# EAGLE design processor board (EAGLE 6.3)
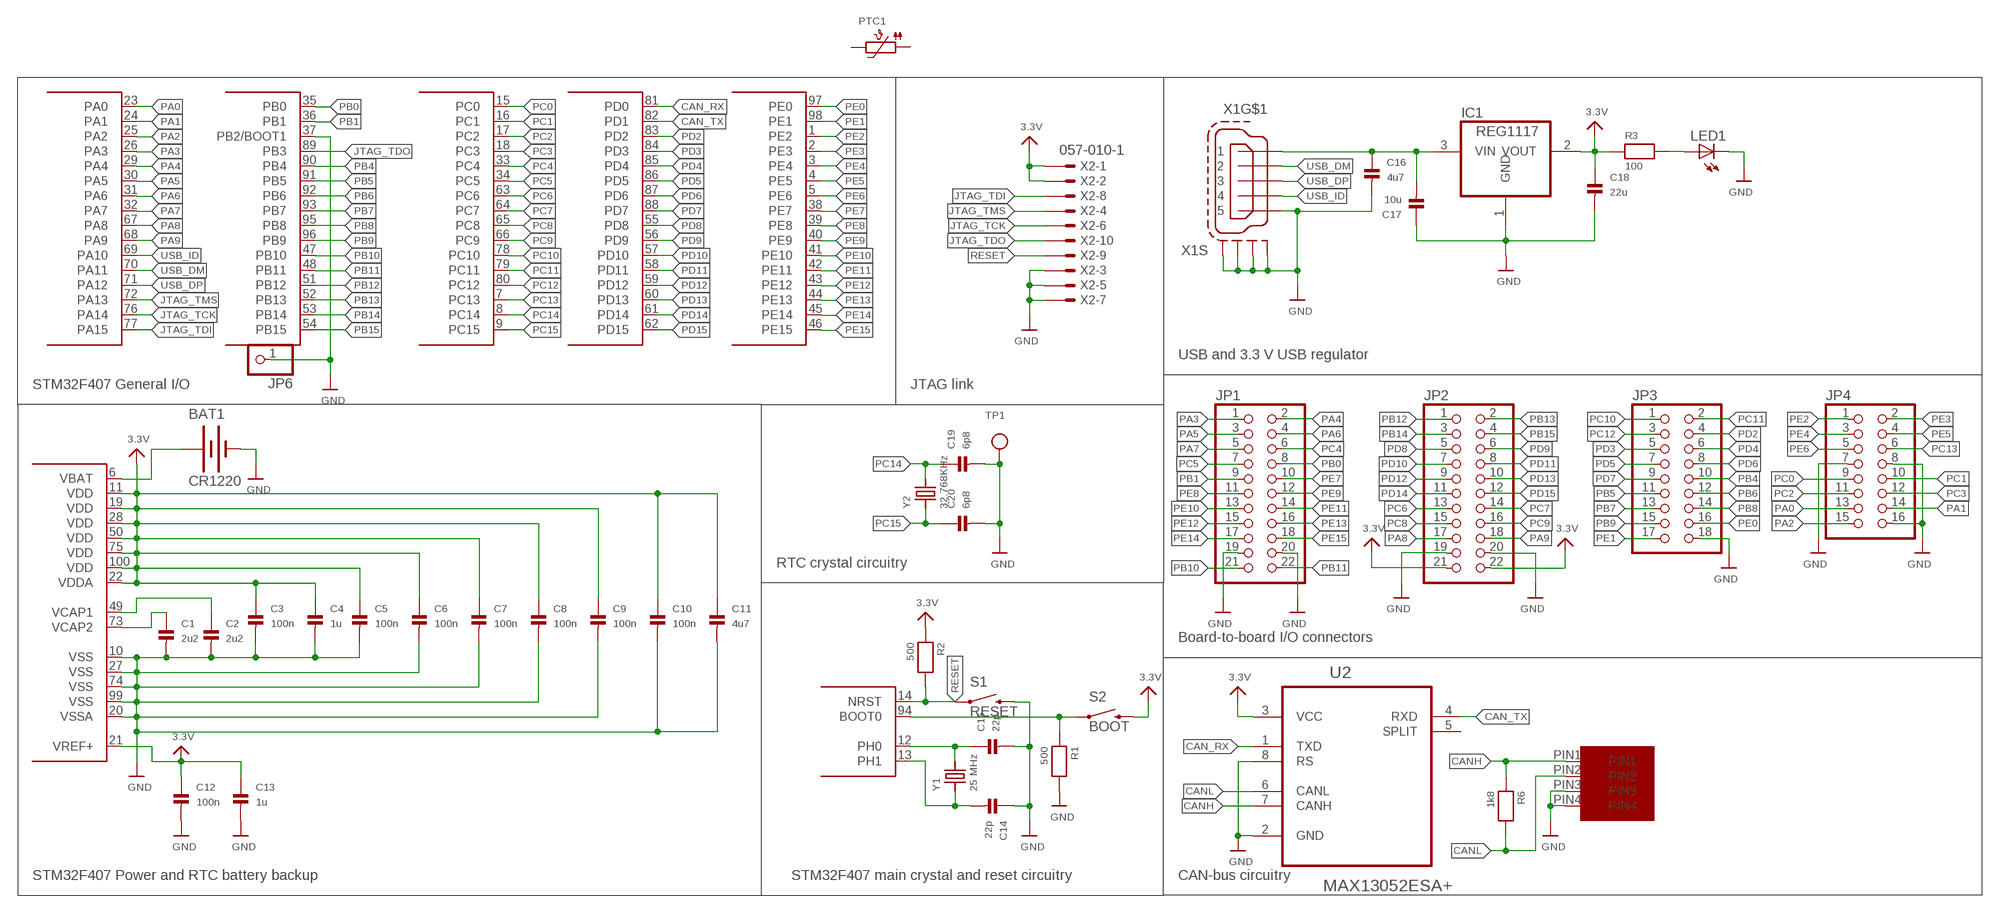
[diagram p0: schematic, sheet 1]

## Parts
BAT1  CR1220  BATTERY12PTH  [BATTCON_12MM_PTH]
C1  2u2  CAP_CERAMIC_0603MP  [_0603MP]
C2  2u2  CAP_CERAMIC_0603MP  [_0603MP]
C3  100n  CAP_CERAMIC_0603MP  [_0603MP]
C4  1u  CAP_CERAMIC_0603MP  [_0603MP]
C5  100n  CAP_CERAMIC_0603MP  [_0603MP]
C6  100n  CAP_CERAMIC_0603MP  [_0603MP]
C7  100n  CAP_CERAMIC_0603MP  [_0603MP]
C8  100n  CAP_CERAMIC_0603MP  [_0603MP]
C9  100n  CAP_CERAMIC_0603MP  [_0603MP]
C10  100n  CAP_CERAMIC_0603MP  [_0603MP]
C11  4u7  CAP_CERAMIC_0603MP  [_0603MP]
C12  100n  CAP_CERAMIC_0603MP  [_0603MP]
C13  1u  CAP_CERAMIC_0603MP  [_0603MP]
C14  22p  CAP_CERAMIC_0603MP  [_0603MP]
C15  22p  CAP_CERAMIC_0603MP  [_0603MP]
C16  4u7  CAP_CERAMIC_0603MP  [_0603MP]
C17  10u  CAP_CERAMIC_0603MP  [_0603MP]
C18  22u  CAP_CERAMIC_0603MP  [_0603MP]
C19  6p8  CAP_CERAMIC_0603MP  [_0603MP]
C20  6p8  CAP_CERAMIC_0603MP  [_0603MP]
IC1  REG1117  [SOT223]
JP1  PINHD-2X11  [2X11]
JP2  PINHD-2X11  [2X11]
JP3  PINHD-2X9  [2X09]
JP4  PINHD-2X8  [2X08]
JP6  PINHD-1X1  [1X01]
LED1  LEDCHIPLED_1206  [CHIPLED_1206]
PTC1  PTC1206  [1206]
R1  500  RESISTOR_0603MP  [_0603MP]
R2  500  RESISTOR_0603MP  [_0603MP]
R3  100  RESISTOR_0603MP  [_0603MP]
R6  1k8  RESISTOR_0603MP  [_0603MP]
S1  RESET  SWITCH-MOMENTARY-2SMD-1101NE  [TACTILE-SWITCH-1101NE]
S2  BOOT  SWITCH-MOMENTARY-2SMD-1101NE  [TACTILE-SWITCH-1101NE]
TP1  TESTPOINT0.1"  [1X01_ROUND]
U1  STM32F4-100  [SQFP-S-14X14-100]
U2  MAX13052ESA+  [SOIC127P600X175-8N]
U$23  MICROFIT4  [MICROFIT4SOCK]
X1  MINI-USB-SCHIELD-32005-201  [32005-201]
X2  057-010-1  [057-010-1]
Y1  25 MHz  CRYSTAL2.5X2.0MM  [CRYSTAL_2.5X2]
Y2  32.768KHz  CRYSTAL32.768  [CRYSTAL_CYL_2X6MM_SMT]

## Nets
3.3V: C3.1 C4.1 C5.1 C6.1 C7.1 C8.1 C9.1 C10.1 C11.1 C12.1 C13.1 C18.1 IC1.2(VOUT) JP2.21 JP2.22 R2.1 R3.1 S2.2 U1.11(VDD) U1.19(VDD) U1.21(VREF+) U1.22(VDDA) U1.28(VDD) U1.50(VDD) U1.75(VDD) U1.100(VDD) U2.3(VCC) X2.1 X2.2
CAN_RX: U1.81(PD0) U2.1(TXD)
CAN_TX: U1.82(PD1) U2.4(RXD)
CANH: R6.1 U2.7(CANH) U$23.PIN1
CANL: R6.2 U2.6(CANL) U$23.PIN2
GND: BAT1.GND(-) C1.2 C2.2 C3.2 C4.2 C5.2 C6.2 C7.2 C8.2 C9.2 C10.2 C11.2 C12.2 C13.2 C14.1 C15.2 C16.2 C17.1 C18.2 C19.2 C20.2 IC1.1(GND) JP1.19 JP1.20 JP2.19 JP2.20 JP3.18 JP4.7 JP4.8 JP4.16 JP6.1 LED1.C R1.2 S1.2 TP1.1 U1.10(VSS) U1.20(VSSA) U1.27(VSS) U1.37(PB2/BOOT1) U1.74(VSS) U1.99(VSS) U2.2(GND) U2.8(RS) U$23.PIN3 U$23.PIN4 X1.5 X1.M1(S:S1) X1.M2(S:S2) X1.M3(S:S3) X1.M4(S:S4) X2.3 X2.5 X2.7
JTAG_TCK: U1.76(PA14) X2.6
JTAG_TDI: U1.77(PA15) X2.8
JTAG_TDO: U1.89(PB3) X2.10
JTAG_TMS: U1.72(PA13) X2.4
N$1: C15.1 U1.12(PH0) Y1.3
N$2: C1.1 U1.73(VCAP2)
N$3: C2.1 U1.49(VCAP1)
N$4: R1.1 S2.1 U1.94(BOOT0)
N$5: LED1.A R3.2
N$6: BAT1.VCC@1(+) U1.6(VBAT)
N$11: C14.2 U1.13(PH1) Y1.1
PA0: JP4.13 U1.23(PA0)
PA1: JP4.14 U1.24(PA1)
PA2: JP4.15 U1.25(PA2)
PA3: JP1.1 U1.26(PA3)
PA4: JP1.2 U1.29(PA4)
PA5: JP1.3 U1.30(PA5)
PA6: JP1.4 U1.31(PA6)
PA7: JP1.5 U1.32(PA7)
PA8: JP2.17 U1.67(PA8)
PA9: JP2.18 U1.68(PA9)
PB0: JP1.8 U1.35(PB0)
PB1: JP1.9 U1.36(PB1)
PB4: JP3.10 U1.90(PB4)
PB5: JP3.11 U1.91(PB5)
PB6: JP3.12 U1.92(PB6)
PB7: JP3.13 U1.93(PB7)
PB8: JP3.14 U1.95(PB8)
PB9: JP3.15 U1.96(PB9)
PB10: JP1.21 U1.47(PB10)
PB11: JP1.22 U1.48(PB11)
PB12: JP2.1 U1.51(PB12)
PB13: JP2.2 U1.52(PB13)
PB14: JP2.3 U1.53(PB14)
PB15: JP2.4 U1.54(PB15)
PC0: JP4.9 U1.15(PC0)
PC1: JP4.10 U1.16(PC1)
PC2: JP4.11 U1.17(PC2)
PC3: JP4.12 U1.18(PC3)
PC4: JP1.6 U1.33(PC4)
PC5: JP1.7 U1.34(PC5)
PC6: JP2.13 U1.63(PC6)
PC7: JP2.14 U1.64(PC7)
PC8: JP2.15 U1.65(PC8)
PC9: JP2.16 U1.66(PC9)
PC10: JP3.1 U1.78(PC10)
PC11: JP3.2 U1.79(PC11)
PC12: JP3.3 U1.80(PC12)
PC13: JP4.6 U1.7(PC13)
PC14: C19.1 U1.8(PC14) Y2.2
PC15: C20.1 U1.9(PC15) Y2.1
PD2: JP3.4 U1.83(PD2)
PD3: JP3.5 U1.84(PD3)
PD4: JP3.6 U1.85(PD4)
PD5: JP3.7 U1.86(PD5)
PD6: JP3.8 U1.87(PD6)
PD7: JP3.9 U1.88(PD7)
PD8: JP2.5 U1.55(PD8)
PD9: JP2.6 U1.56(PD9)
PD10: JP2.7 U1.57(PD10)
PD11: JP2.8 U1.58(PD11)
PD12: JP2.9 U1.59(PD12)
PD13: JP2.10 U1.60(PD13)
PD14: JP2.11 U1.61(PD14)
PD15: JP2.12 U1.62(PD15)
PE0: JP3.16 U1.97(PE0)
PE1: JP3.17 U1.98(PE1)
PE2: JP4.1 U1.1(PE2)
PE3: JP4.2 U1.2(PE3)
PE4: JP4.3 U1.3(PE4)
PE5: JP4.4 U1.4(PE5)
PE6: JP4.5 U1.5(PE6)
PE7: JP1.10 U1.38(PE7)
PE8: JP1.11 U1.39(PE8)
PE9: JP1.12 U1.40(PE9)
PE10: JP1.13 U1.41(PE10)
PE11: JP1.14 U1.42(PE11)
PE12: JP1.15 U1.43(PE12)
PE13: JP1.16 U1.44(PE13)
PE14: JP1.17 U1.45(PE14)
PE15: JP1.18 U1.46(PE15)
RESET: R2.2 S1.1 U1.14(NRST) X2.9
USB_DM: U1.70(PA11) X1.2
USB_DP: U1.71(PA12) X1.3
USB_ID: U1.69(PA10) X1.4
USB_VBUS: C16.1 C17.2 IC1.3(VIN) X1.1
Unconnected: PTC1.1 PTC1.2 U2.5(SPLIT)

## Notes on the sheet
- USB and 3.3 V USB regulator
- STM32F407 General I/O | JTAG link
- RTC crystal circuitry
- Board-to-board I/O connectors
- STM32F407 Power and RTC battery backup | STM32F407 main crystal and reset circuitry | CAN-bus circuitry

## Library data of the parts
BAT1 = SparkFun-Electromechanical:BATTERY: Battery Holders Various common sizes : AA, AAA, 18650 (PRT-12895), 20mm coin cell and 12mm coin cell. 20MM_4LEGS, BATT-10373; PROD_ID: BATT-08315
C1-C20 = microbuilder:CAP_CERAMIC: Ceramic Capacitors 0402 - 0402 Surface Mount Capacitors 16pF 50V 5% [Digikey: 445-4899-2-ND] 18pF 50V 5% [Digikey: 490-1281-2-ND] 22pF 50V 5% [Digikey: 490-1283-2-ND] 68pF 50V 5% [Digikey: 490-1289-2-ND] 0.1uF 10V 10% [Digikey: 490-1318-2-ND] 1.0uF 6.3V 10% [Digikey: 490-1320-2-ND] 0603 - 0603 Surface Mount Capacitors 16 pF 50V 5% [Digikey: 445-5051-2-ND] 22 pF 50V [Digikey: PCC220ACVTR-ND] 33 pF 50V 5% [Digikey: 490-1415-1-ND] 56pF 50V 5% [Digikey: 490-1421-1-ND] 220pF 50V 5% [Digikey: 445-1285-1-ND] 680 pF 50V 2200 pF 50V 5% C0G [Digikey: 445-1297-1-ND] 5600 pF 100V 5% X7R [Digikey: 478-3711-1-ND] 0.1 µF 25V 10% [Digikey: PCC2277TR-ND] 0.22 µF 16V 10% X7R [Digikey: 445-1318-1-ND] 1.0 µF 25V 10% [Digikey: 445-5146-2-ND] 0603 - RF Specific 3pF 250V +/-0.1pF RF [Digikey: 712-1347-1-ND] 18 pF 250V 5% [Digikey: 478-3505-1-ND or 712-1322-1-ND] 56 pF 250V 5% C0G RF [Digikey: 490-4867-1-ND] 68 pF 250V RF [Digikey: 490-4868-1-ND] 0805 - 0805 Surface Mount Capacitors 220 pF 250V 2% RF Ceramic Capacitor [Digikey: 712-1398-1-ND] 1000 pF 50V 2% NP0 Ceramic Capacitor [Digikey: 478-3760-1-ND] 0.1 µF 25V 10% Ceramic Capacitor [Digikey: PCC1828TR-ND] 1.0 µF 16V 10% Ceramic Capacitor[Digikey: 490-1691-2-ND] 10.0 µF 10V 10% Ceramic Capacitor[Digikey: 709-1228-1-ND] 10.0 uF 16V 10% Ceramic Capacitor [Digikey: 478-5165-2-ND] 47 uF 6.3V 20% Ceramic Capacitor [Digikey: 587-1779-1-ND or 399-5506-1-ND] 1206 - 1206 Surface Mount Capacitors 47uF 10V 20% Ceramic Capacitor [Digikey: 490-5528-1-ND or 399-5508-1-ND or 445-6010-1-ND] 100uF 6.3V -20%, +80% Y5V Ceramic Capacitor (Digikey: 490-4512-1-ND, Mouser: 81-GRM31CF50J107ZE1L)
IC1 = burr-brown:REG1117: 800mA and 1A Low Dropout (LDO) Positive Regulator 1.8V, 2.5V, 2.85V, 3.3V, 5V, and Adj; MPN: REG1117; OC_FARNELL: 1097566; OC_NEWARK: 14P6981
JP1 JP2 = pinhead:PINHD-2X11: PIN HEADER
JP3 = pinhead:PINHD-2X9: PIN HEADER
JP4 = pinhead:PINHD-2X8: PIN HEADER
JP6 = pinhead:PINHD-1X1: PIN HEADER
LED1 = led:LED: LED OSRAM: - CHIPLED LG R971, LG N971, LY N971, LG Q971, LY Q971, LO R971, LY R971 LH N974, LH R974 LS Q976, LO Q976, LY Q976 LO Q996 - Hyper CHIPLED LW Q18S LB Q993, LB Q99A, LB R99A - SideLED LS A670, LO A670, LY A670, LG A670, LP A670 LB A673, LV A673, LT A673, LW A673 LH A674 LY A675 LS A676, LA A676, LO A676, LY A676, LW A676 LS A679, LY A679, LG A679 - Hyper Micro SIDELED® LS Y876, LA Y876, LO Y876, LY Y876 LT Y87S - SmartLED LW L88C, LW L88S LB L89C, LB L89S, LG L890 LS L89K, LO L89K, LY L89K LS L896, LA L896, LO L896, LY L896 - TOPLED LS T670, LO T670, LY T670, LG T670, LP T670 LSG T670, LSP T670, LSY T670, LOP T670, LYG T670 LG T671, LOG T671, LSG T671 LB T673, LV T673, LT T673, LW T673 LH T674 LS T676, LA T676, LO T676, LY T676, LB T676, LH T676, LSB T676, LW T676 LB T67C, LV T67C, LT T67C, LS T67K, LO T67K, LY T67K, LW E67C LS E67B, LA E67B, LO E67B, LY E67B, LB E67C, LV E67C, LT E67C LW T67C LS T679, LY T679, LG T679 LS T770, LO T770, LY T770, LG T770, LP T770 LB T773, LV T773, LT T773, LW T773 LH T774 LS E675, LA E675, LY E675, LS T675 LS T776, LA T776, LO T776, LY T776, LB T776 LHGB T686 LT T68C, LB T68C - Hyper Mini TOPLED® LB M676 - Mini TOPLED Santana® LG M470 LS M47K, LO M47K, LY M47K Source: http://www.osram.convergy.de LUXEON: - LUMILED® LXK2-PW12-R00, LXK2-PW12-S00, LXK2-PW14-U00, LXK2-PW14-V00 LXK2-PM12-R00, LXK2-PM12-S00, LXK2-PM14-U00 LXK2-PE12-Q00, LXK2-PE12-R00, LXK2-PE12-S00, LXK2-PE14-T00, LXK2-PE14-U00 LXK2-PB12-K00, LXK2-PB12-L00, LXK2-PB12-M00, LXK2-PB14-N00, LXK2-PB14-P00, LXK2-PB14-Q00 LXK2-PR12-L00, LXK2-PR12-M00, LXK2-PR14-Q00, LXK2-PR14-R00 LXK2-PD12-Q00, LXK2-PD12-R00, LXK2-PD12-S00 LXK2-PH12-R00, LXK2-PH12-S00 LXK2-PL12-P00, LXK2-PL12-Q00, LXK2-PL12-R00 Source: www.luxeon.com KINGBRIGHT: KA-3528ASYC Source: www.kingbright.com
PTC1 = microbuilder:PTC: PTC (Resettable Fuse) 1206 Package 250mA PTC (16V Max, Time-to-Trip: 0.08s) - Digikey: F2110CT-ND 1210 Package 100mA PTC (30V Max, Time-to-Trip: 0.6s) - Digikey: MF-USMF010-2CT-ND 1812 Package 750mA PTC (24V Max, Time-to-Trip: 0.2s) - Digikey: MF-MSMF075/24-2CT-ND
R1-R3 R6 = microbuilder:RESISTOR: Resistors 0402 - 0402 Surface Mount Package 22 Ohm 1% 1/16W [Digikey: 311-22.0LRTR-ND] 33 Ohm 5% 1/16W 1.0K 5% 1/16W 1.5K 5% 1/16W 2.0K 1% 1/16W 10.0K 1% 1/16W [Digikey: 311-10.0KLRTR-ND] 10.0K 5% 1/16W [Digikey: RMCF0402JT10K0TR-ND] 12.1K 1% 1/16W [Digikey: 311-22.0LRTR-ND] 100.0K 5% 1/16W 0603 - 0603 Surface Mount Package 0 Ohm 1/10 Watt 1% Resistor 15 Ohm 1/10 Watt 1% Resistor 33 Ohm 1/10 Watt 1% Resistor 49.9 Ohm 1/10 Watt 1% Resistor 100 Ohm 1/10 Watt 1% Resistor 150 Ohm 1/10 Watt 1% Resistor 240 Ohm 1/10 Watt 1% Resistor 390 Ohm 1/10 Watt 1% Resistor 560 Ohm 1/10 Watt 1% Resistor 680 Ohm 1/10 Watt 1% Resistor 750 Ohm 1/10 Watt 1% Resistor 1.0K Ohm 1/10 Watt 1% Resistor 1.5K Ohm 1/10 Watt 1% Resistor 2.0K Ohm 1/10 Watt 1% Resistor 2.2K Ohm 1/10 Watt 1% Resistor 3.3K Ohm 1/10 Watt 1% Resistor 4.7K Ohm 1/10 Watt 1% Resistor 10.0K Ohm 1/10 Watt 1% Resistor 12.0K Ohm 1/10 Watt 1% Resistor 12.1K Ohm 1/10 Watt 1% Resistor 20.0K Ohm 1/10 Watt 1% Resistor 33.0K Ohm 1/10 Watt 1% Resistor 100.0K Ohm 1/10 Watt 1% Resistor 0805 - 0805 Surface Mount Package 0 Ohm 1/8 Watt 1% Resistor 33 Ohm 1/8 Watt 1% Resistor 100 Ohm 1/8 Watt 1% Resistor 150 Ohm 1/8 Watt 1% Resistor 200 Ohm 1/8 Watt 1% Resistor 240 Ohm 1/8 Watt 1% Resistor 330 Ohm 1/8 Watt 1% Resistor 390 Ohm 1/8 Watt 1% Resistor 470 Ohm 1/8 Watt 1% Resistor 1.0K Ohm 1/8 Watt 1% Resistor 1.5K Ohm 1/8 Watt 1% Resistor 2.0K Ohm 1/8 Watt 1% Resistor 4.7K Ohm 1/8 Watt 1% Resistor 5.1K Ohm 1/8 Watt 1% Resistor 5.6K Ohm 1/8 Watt 1% Resistor 10.0K Ohm 1/8 Watt 1% Resistor 22.0K Ohm 1/8 Watt 1% Resistor 33.0K Ohm 1/8 Watt 1% Resistor 100K Ohm 1/8 Watt 1% Resistor 1206 - 1206 Surface Mount Package 2012 - 2010 Surface Mount Package 0.11 Ohm 1/2 Watt 1% Resistor - Digikey: RHM.11UCT-ND
S1 S2 = SparkFun-Electromechanical:SWITCH-MOMENTARY-2: Various NO switches- pushbuttons, reed, etc; PROD_ID: SWCH-00815
TP1 = microbuilder:TESTPOINT: Test Point Various test points for characterisation and PCB testing TESTPOINT_SMT - Compact Surface Mount Test Point [Digikey: 5016KTR-ND]; BOM: EXCLUDE
U1 = apbteam_stm32:STM32F4-100: STM32F4, 100 pin package According to STM32F40x datasheet, almost compatible with STM32F4xx, STM32F2xx, some pins must be connected differently, see chapter 2.1.
U2 = Maxim_By_element14_Batch_1:MAX13052ESA+: Industry-Standard High-Speed CAN Transceivers with ±80V Fault Protection; MPN: MAX13052ESA+; OC_FARNELL: 1600112; OC_NEWARK: 99K2875; PACKAGE: SOIC-8; SUPPLIER: Maxim
U$23 = unicorn:MICROFIT4
X1 = con-cypressindustries:MINI-USB-SCHIELD-: MINI USB-B Conector Source: www.cypressindustries.com; OC_FARNELL: unknown; OC_NEWARK: unknown
X2 = con-panduit:057-010-: CONNECTOR 10-pin series 057 contact pc board low profile headers; OC_FARNELL: unknown; OC_NEWARK: unknown
Y1 Y2 = microbuilder:CRYSTAL: Crystals HC49UP - Surface Mount Crystal 4.0MHz 18pF +/-30ppm Surface Mount Crystal [Digikey: 535-9857-1-ND] 12.0 MHz Surface Mount Crystal [Digikey: 535-9869-6-ND] 25.0 MHz Surface Mount Crystal [Digikey: 535-9078-1-ND] 2.5 x 2.0mm - MEMs SMT Crystal 16.0 MHz 10pF 20ppm 2.5 x 2.0mm Crystal [Digikey -40-85°C: 535-10923-1-ND] 3.2 x 2.5mm - MEMs SMT Crystal 12.0 MHz 8pF 15ppm 3.2 x 2.5mm Crystal [Digikey: -10-70°C: 644-1047-1-ND -40-125°C: 644-1128-1-ND] 16.0 MHz 8pF 15ppm 3.2 x 2.5mm Crystal [Digikey: -10-70°C: 644-1049-1-ND -40-125°C: 644-1129-2-ND] 16.0 MHz 10pF 10ppm 3.2 x 2.5mm Crystal [Digikey: 644-1100-1-ND] 27.12 MHz 18pF 30ppm 3.2 x 2.5mm Crystal [Digikey: 887-1424-1-ND] 27.12MHz 10pF 10ppm 3.2 x 2.5mm Crystal [Digikey: 887-1329-1-ND] 4.9 x 1.8mm - MEMs SMT Crystal 32.768 KHz 12.5pF 20ppm 4.9 x 1.8mm Crystal [Digikey: SE2415CT-ND] 8.0 x 3.8mm - Surface Mount Crystal 32.768kHz 12.5pF 20ppm -40°C-85°C [Digikey: 535-9166-2-ND] Cylinder 32.768KHz Cylinder Crystal (2x6mm body) [Ex. Digikey: 300-8341-2-ND]

## Board
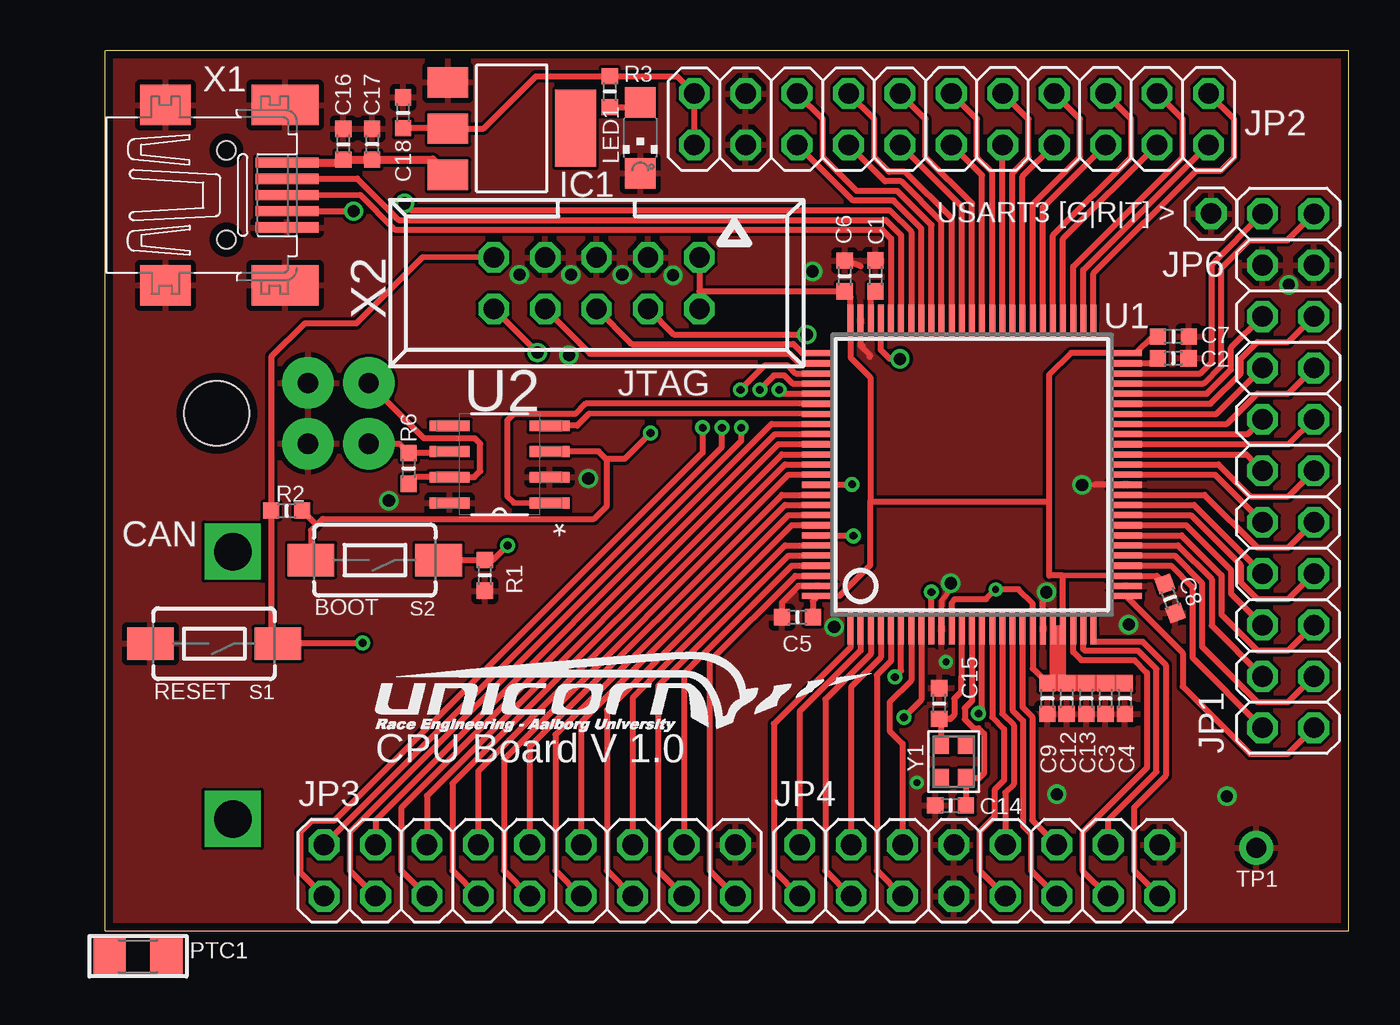
[diagram p1: board, top side]
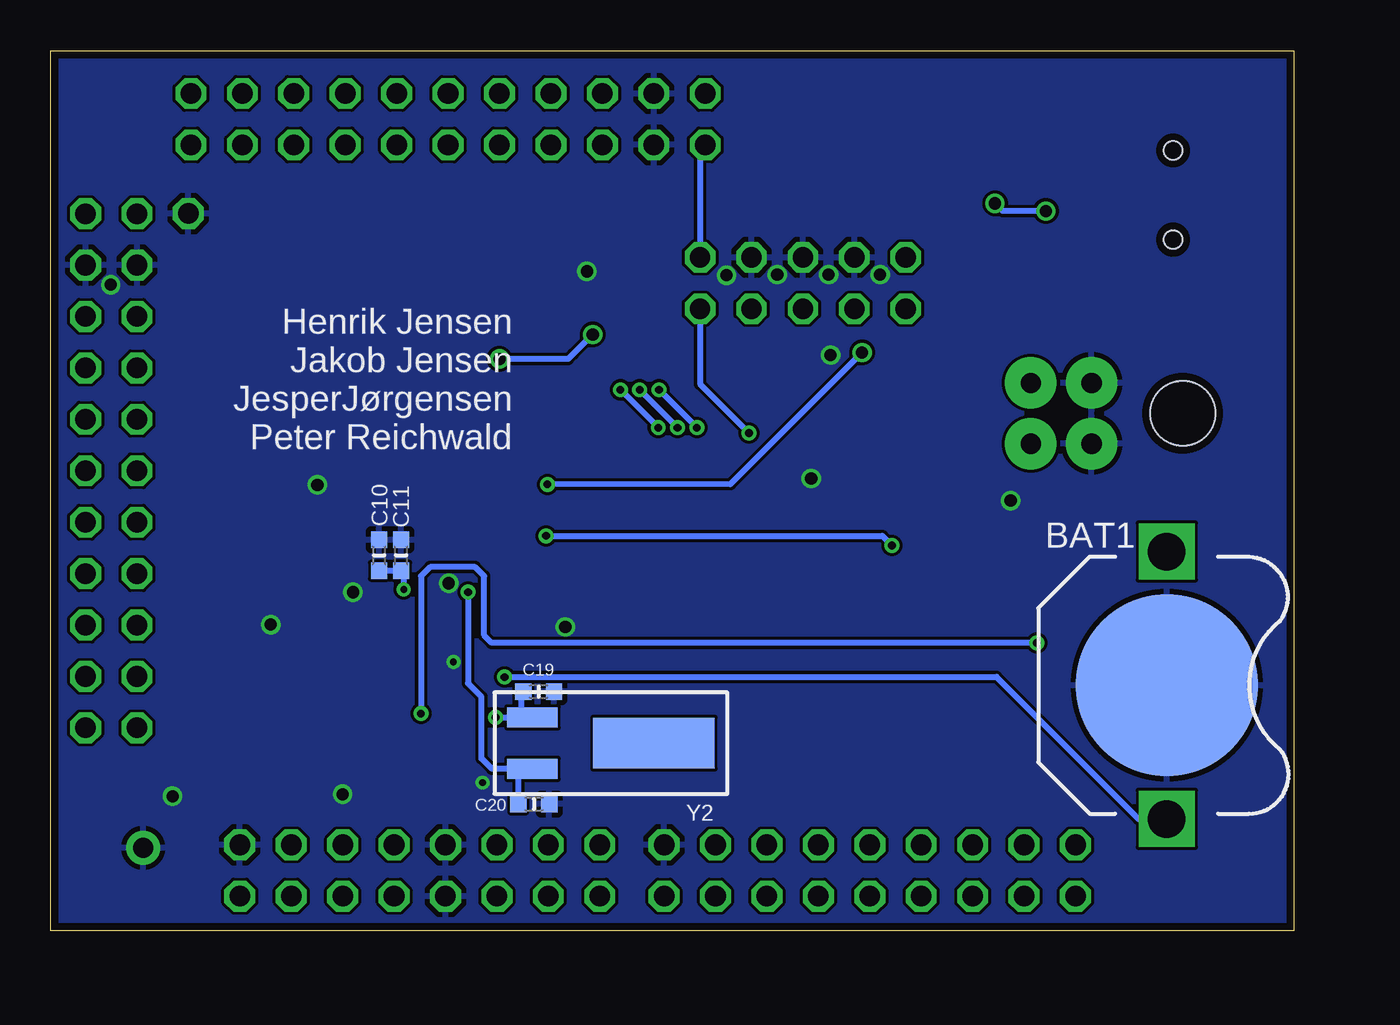
[diagram p2: board, bottom side, seen from below]

Size 61.42 x 43.49 mm. Coordinates in mm from the lower left corner, seen from the top.
Outline: 61.42,0 61.42,43.48 0,43.48
Outline: 61.42,0.01 0,0.01 0,43.49
Copper layers (1*16): Top 0.0356mm / dielectric 1.5011mm / Bottom 0.0356mm
Design rules "LaenPCBOrder *": minimum track width 6mil, minimum drill 13mil, track to track 6mil, track to pad 6mil, pad to pad 6mil, via to via 6mil, smd to smd 6mil, copper to edge 15mil, drill to drill 6mil, minimum pad ring 7mil, minimum via ring 7mil, stop-mask expansion 3mil, vias tented up to drill 0mil, thermal gap 10mil

### Footprints (pad centres in the part's own frame; a part is rotated, then mirrored left to right if it is on the bottom)
BATTCON_12MM_PTH = smd 9 x 9: GND 0,0 | drill 1.854 square: VCC@1 6.604,0; VCC@2 -6.604,0
_0603MP = smd 0.8 x 0.8: 1 -0.762,0; 2 0.762,0
SOT223 = smd 1.499 x 2.007: 1 -2.261,-3.15; 2 0.025,-3.15; 3 2.311,-3.15 | smd 3.81 x 2.007: 4 0,3.15
2X11 = drill 1.016 octagon: 1 -12.7,-1.27; 2 -12.7,1.27; 3 -10.16,-1.27; 4 -10.16,1.27; 5 -7.62,-1.27; 6 -7.62,1.27; 7 -5.08,-1.27; 8 -5.08,1.27; 9 -2.54,-1.27; 10 -2.54,1.27; 11 0,-1.27; 12 0,1.27; 13 2.54,-1.27; 14 2.54,1.27; 15 5.08,-1.27; 16 5.08,1.27; 17 7.62,-1.27; 18 7.62,1.27; 19 10.16,-1.27; 20 10.16,1.27; 21 12.7,-1.27; 22 12.7,1.27
2X09 = drill 1.016 octagon: 1 -10.16,-1.27; 2 -10.16,1.27; 3 -7.62,-1.27; 4 -7.62,1.27; 5 -5.08,-1.27; 6 -5.08,1.27; 7 -2.54,-1.27; 8 -2.54,1.27; 9 0,-1.27; 10 0,1.27; 11 2.54,-1.27; 12 2.54,1.27; 13 5.08,-1.27; 14 5.08,1.27; 15 7.62,-1.27; 16 7.62,1.27; 17 10.16,-1.27; 18 10.16,1.27
2X08 = drill 1.016 octagon: 1 -8.89,-1.27; 2 -8.89,1.27; 3 -6.35,-1.27; 4 -6.35,1.27; 5 -3.81,-1.27; 6 -3.81,1.27; 7 -1.27,-1.27; 8 -1.27,1.27; 9 1.27,-1.27; 10 1.27,1.27; 11 3.81,-1.27; 12 3.81,1.27; 13 6.35,-1.27; 14 6.35,1.27; 15 8.89,-1.27; 16 8.89,1.27
1X01 = drill 1.016 octagon: 1 0,0
CHIPLED_1206 = smd 1.5 x 1.5: A 0,-1.75; C 0,1.75
1206 = smd 1.6 x 1.8: 1 -1.4,0; 2 1.4,0
TACTILE-SWITCH-1101NE = smd 2.3 x 1.6: 1 -3.15,0; 2 3.15,0
1X01_ROUND = drill 1 pad 1.676: 1 0,0
SQFP-S-14X14-100 = smd 0.3 x 1.6: 1 -6,-7.6; 2 -5.5,-7.6; 3 -5,-7.6; 4 -4.5,-7.6; 5 -4,-7.6; 6 -3.5,-7.6; 7 -3,-7.6; 8 -2.5,-7.6; 9 -2,-7.6; 10 -1.5,-7.6; 11 -1,-7.6; 12 -0.5,-7.6; 13 0,-7.6; 14 0.5,-7.6; 15 1,-7.6; 16 1.5,-7.6; 17 2,-7.6; 18 2.5,-7.6; 19 3,-7.6; 20 3.5,-7.6; 21 4,-7.6; 22 4.5,-7.6; 23 5,-7.6; 24 5.5,-7.6; 25 6,-7.6; 51 6,7.6; 52 5.5,7.6; 53 5,7.6; 54 4.5,7.6; 55 4,7.6; 56 3.5,7.6; 57 3,7.6; 58 2.5,7.6; 59 2,7.6; 60 1.5,7.6; 61 1,7.6; 62 0.5,7.6; 63 0,7.6; 64 -0.5,7.6; 65 -1,7.6; 66 -1.5,7.6; 67 -2,7.6; 68 -2.5,7.6; 69 -3,7.6; 70 -3.5,7.6; 71 -4,7.6; 72 -4.5,7.6; 73 -5,7.6; 74 -5.5,7.6; 75 -6,7.6 | smd 1.6 x 0.3: 26 7.6,-6; 27 7.6,-5.5; 28 7.6,-5; 29 7.6,-4.5; 30 7.6,-4; 31 7.6,-3.5; 32 7.6,-3; 33 7.6,-2.5; 34 7.6,-2; 35 7.6,-1.5; 36 7.6,-1; 37 7.6,-0.5; 38 7.6,0; 39 7.6,0.5; 40 7.6,1; 41 7.6,1.5; 42 7.6,2; 43 7.6,2.5; 44 7.6,3; 45 7.6,3.5; 46 7.6,4; 47 7.6,4.5; 48 7.6,5; 49 7.6,5.5; 50 7.6,6; 76 -7.6,6; 77 -7.6,5.5; 78 -7.6,5; 79 -7.6,4.5; 80 -7.6,4; 81 -7.6,3.5; 82 -7.6,3; 83 -7.6,2.5; 84 -7.6,2; 85 -7.6,1.5; 86 -7.6,1; 87 -7.6,0.5; 88 -7.6,0; 89 -7.6,-0.5; 90 -7.6,-1; 91 -7.6,-1.5; 92 -7.6,-2; 93 -7.6,-2.5; 94 -7.6,-3; 95 -7.6,-3.5; 96 -7.6,-4; 97 -7.6,-4.5; 98 -7.6,-5; 99 -7.6,-5.5; 100 -7.6,-6
SOIC127P600X175-8N = smd 1.981 x 0.533: 1 -2.464,1.905; 2 -2.464,0.635; 3 -2.464,-0.635; 4 -2.464,-1.905; 5 2.464,-1.905; 6 2.464,-0.635; 7 2.464,0.635; 8 2.464,1.905
MICROFIT4SOCK = drill 1 pad 2.54: PIN1 -2,0; PIN2 1,0; PIN3 -2,-3; PIN4 1,-3 | hole 3.2: -0.5,-7.5
32005-201 = smd 3.1 x 0.5: 1 3,1.6; 2 3,0.8; 3 3,0; 4 3,-0.8; 5 3,-1.6 | smd 2.5 x 2: M1 -3,-4.45; M2 -3,4.45 | smd 3.3 x 2: M3 2.9,4.45; M4 2.9,-4.45 | hole 0.9: 0,2.2; 0,-2.2
057-010-1 = drill 1 octagon: 1 -5.08,-1.27; 2 -5.08,1.27; 3 -2.54,-1.27; 4 -2.54,1.27; 5 0,-1.27; 6 0,1.27; 7 2.54,-1.27; 8 2.54,1.27; 9 5.08,-1.27; 10 5.08,1.27
CRYSTAL_2.5X2 = smd 0.9 x 0.8: 1 -0.825,-0.625; 2 0.825,-0.625; 3 0.825,0.625; 4 -0.825,0.625
CRYSTAL_CYL_2X6MM_SMT = smd 2.5 x 1: 1 2.125,1.27; 2 2.125,-1.27 | smd 6 x 2.5: CYLINDER -3.875,0

### Placement (x,y rotation side)
BAT1  6.29,12.14 270 bottom
C1  38.04,32.36 90 top
C2  52.74,28.29 0 top
C3  49.4,11.48 270 top
C4  50.36,11.48 270 top
C5  34.18,15.5 180 top
C6  36.51,32.36 90 top
C7  52.75,29.37 0 top
C8  52.59,16.43 290 top
C9  46.52,11.48 270 top
C10  44.11,18.56 90 bottom
C11  45.19,18.56 90 bottom
C12  47.48,11.48 270 top
C13  48.45,11.48 270 top
C14  41.75,6.2 0 top
C15  41.18,11.23 90 top
C16  11.75,38.86 90 top
C17  13.18,38.86 270 top
C18  14.7,40.42 90 top
C19  37.31,11.82 0 bottom
C20  37.55,6.27 0 bottom
IC1  20.07,39.66 270 top
JP1  58.42,22.73 90 top
JP2  41.79,40.1 180 top
JP3  20.96,2.98 0 top
JP4  43.18,2.98 0 top
JP6  54.62,35.44 90 top
LED1  26.42,39.18 180 top
PTC1  1.61,-1.24 0 top
R1  18.74,17.57 270 top
R2  8.95,20.76 180 top
R3  24.91,41.46 270 top
R6  14.98,22.85 90 top
S1  5.37,14.19 180 top
S2  13.31,18.32 180 top
TP1  56.84,4.11 0 top
U1  42.8,22.54 0 top
U2  19.46,23.05 180 top
U$23  13,25.07 270 top
X1  5.97,36.35 0 top
X2  24.26,32 180 top
Y1  41.89,8.37 90 top
Y2  35.5,9.28 180 bottom

### Tracks (layer width: path | path; a pad name or v marks a point on that pad's centre or on a via)
3.3V  (via drill 0.33, 0.38)
  Top 0.254: U1.22 U1.21 46.8,14.7 47.06,14.7
  Top 0.305: 47.3,17.55 U1.28 51.93,17.54 C8.1 | 47.3,17.55 46.61,17.55 46.61,21.22 | U1.22 47.3,17.55 | 46.61,21.22 46.61,27.47 47.69,28.55 U1.50 50.9,28.54 51.73,29.37 C7.1 | 37.78,21.22 37.78,27.35 36.8,28.33 U1.75 36.8,31.31 C6.1 29.34,31.59 | 24.72,23.32 24.77,23.28 24.77,21 24.13,20.36 10.73,20.36 10.37,20 | JP2.22 JP2.21 28.23,42.22 R3.1 21.26,42.22 18.68,39.64 IC1.2 arc90 16.89,39.67 C18.1 | 37.78,21.22 46.61,21.22 | U1.11 41.8,16.19 41.94,16.39 43.49,16.39 v43.98,16.87 45.1,16.87 45.8,16.17 U1.19 45.8,12.96 C9.1 | v26.92,24.6 25.65,23.32 24.72,23.32 | 37.78,21.22 37.78,18.08 36.26,16.55 U1.100 34.95,16.29 C5.1 | 24.72,23.32 24.36,23.69 U2.3 | 10.37,20 10.15,19.79 S2.2 | R2.1 10.37,20.11 10.37,20 | 29.34,31.59 X2.2 | X2.1 29.34,31.59
  Top 0.813: 47.06,14.7 47.06,12.24 | 47.06,12.24 C12.1 C13.1 C3.1 | C3.1 | C3.1 C4.1 | C4.1 | 47.06,12.24 C9.1
  Bottom 0.305: JP2.22 29.34,38.59 X2.1 | X2.2 29.34,27.02 v26.92,24.6 | C11.1 C10.1 | C10.1 | C10.1 43.98,17.8 v43.98,16.87
CAN_RX
  Top 0.305: U1.81 23.73,26.05 23.21,25.54 20.16,25.54 19.84,25.22 19.84,21.47 20.16,21.15 U2.1
CAN_TX
  Top 0.305: U1.82 23.89,25.55 23.3,24.97 U2.4
CANH
  Top 0.305: 17,22.46 U2.7 | U$23.PIN1 15.73,24.33 18.26,24.33 18.51,24.08 18.51,22.71 18.21,22.42 U2.7 | U2.7 15.31,22.42 R6.1
CANL
  Top 0.305: U2.6 16.93,23.61 R6.2 14.52,24.07 U$23.PIN2
GND  (via drill 0.33, 0.6)
  Top 0.254: 41.31,14.95 41.31,16.33 41.56,16.61 v41.75,17.18
  Top 0.305: U1.74 37.3,28.9 | 37.3,28.9 37.4,28.9 | 37.3,28.9 37.75,28.45 37.75,28.36 | U1.37 48.86,22.05 48.86,22.04 | U1.20 46.3,16.19 v46.48,16.73 | 37.3,32.84 C6.2 | U1.99 34.22,17.04 33.42,16.23 C5.2
  other vias: 35.99,15.02 34.93,32.59 22.99,32.42 25.53,32.42 28.04,32.39 14,21.26 23.85,22.35 40.08,7.33 22.89,28.45 48.24,22.04 50.55,15.13 20.45,32.42 46.99,6.75 55.4,6.65 41.52,13.29 58.45,31.92
  pour Bottom: 0,0.01 61.59,0.01 61.59,43.51 0,43.51
  pour Top: 0.01,0.01 0.01,43.48 61.42,43.48 61.42,0.01
JTAG_TCK
  Top 0.305: U1.76 34.43,28.54 33.97,29 26,29 X2.6
JTAG_TDI
  Top 0.305: U1.77 34.26,28.04 33.78,28.52 23.93,28.52 X2.8
JTAG_TDO  (via drill 0.38, 0.6)
  Top 0.305: X2.10 v21.34,28.57 | U1.89 36.85,22.05 v36.88,22.06
  Bottom 0.305: v21.34,28.57 27.84,22.08 v36.88,22.06
JTAG_TMS  (via drill 0.6)
  Top 0.305: U1.72 38.3,28.7 38.75,28.26 v39.24,28.26 | X2.4 28.07,29.46 v34.64,29.46
  Bottom 0.305: v34.64,29.46 35.62,28.49 35.86,28.26 v39.24,28.26
N$1
  Top 0.305: U1.12 42.25,11.8 41.93,11.48 41.93,10.68 41.72,10.47 C15.1 41.26,10.39 Y1.3
N$2
  Top 0.305: U1.73 37.8,31.36 C1.1
N$3
  Top 0.305: U1.49 51.98,28.04 C2.1
N$4  (via drill 0.38)
  Top 0.305: S2.1 R1.1 19.15,18.33 v19.86,19.04 | U1.94 36.93,19.55 arc-90 v36.94,19.52
  Bottom 0.305: v36.94,19.52 20.34,19.52 v19.86,19.04
N$5
  Top 0.305: R3.2 26.19,40.7 LED1.A
N$6  (via drill 0.38)
  Top 0.305: v38.99,12.54 39.3,12.86 U1.6
  Bottom 0.305: v38.99,12.54 14.7,12.55 7.68,5.53 BAT1.VCC@1
N$11
  Top 0.305: U1.13 42.8,11.37 42.45,11.02 42.45,10.45 42.89,10.01 43.13,10.01 43.4,9.75 43.4,7.79 43.16,7.54 Y1.1 C14.2
PA0
  Top 0.305: JP4.13 48.27,2.98 48.27,4.88 51.45,8.06 51.45,12.76 50.83,13.38 48.2,13.38 47.8,13.78 U1.23
PA1
  Top 0.305: JP4.14 49.53,5.48 51.91,7.86 51.91,12.94 51.02,13.83 48.4,13.83 48.3,13.93 U1.24
PA2
  Top 0.305: U1.25 48.8,14.3 51.22,14.3 52.37,13.14 52.37,7.66 50.8,6.09 50.8,2.98 JP4.15
PA3
  Top 0.305: JP1.1 58.39,8.74 56.55,8.74 53.21,12.07 53.21,13.74 U1.26
PA4
  Top 0.305: JP1.2 53.69,13.5 53.69,17 52.64,18.04 U1.29
PA5
  Top 0.305: JP1.3 58.42,11.31 56.9,11.31 54.17,14.04 54.17,17.19 52.81,18.54 U1.30
PA6
  Top 0.305: JP1.4 54.64,15.09 54.64,17.38 52.98,19.04 U1.31
PA7
  Top 0.305: JP1.5 58.42,13.85 56.9,13.85 55.12,15.63 55.12,17.57 53.14,19.54 U1.32
PA8
  Top 0.305: U1.67 40.8,34.87 39.12,36.55 37.12,36.55 35.43,38.24 35.43,40.11 JP2.17
PA9
  Top 0.305: U1.68 40.3,34.7 38.92,36.08 36.92,36.08 JP2.18
PB0
  Top 0.305: U1.35 53.76,21.04 JP1.8
PB1
  Top 0.305: JP1.9 58.42,18.93 56.9,18.93 54.29,21.54 U1.36
PB4
  Top 0.305: JP3.10 20.95,9.09 33.41,21.54 U1.90
PB5
  Top 0.305: JP3.11 22.23,2.99 22.23,9.69 33.57,21.04 U1.91
PB6
  Top 0.305: JP3.12 23.5,10.3 33.74,20.54 U1.92
PB7
  Top 0.305: JP3.13 24.77,2.99 24.77,10.9 33.91,20.04 U1.93
PB8
  Top 0.305: JP3.14 26.04,11.5 33.57,19.04 U1.95
PB9
  Top 0.305: JP3.15 27.3,2.99 27.3,12.11 33.74,18.54 U1.96
PB10
  Top 0.305: U1.47 54.24,27.04 55.12,27.92 55.12,32.73 56.51,34.12 58.38,34.12 JP1.21
PB11
  Top 0.305: U1.48 54.08,27.54 54.64,28.11 54.64,32.92 JP1.22
PB12
  Top 0.305: U1.51 48.8,32.49 53.88,37.57 55.09,37.57 55.75,38.24 55.75,40.11 JP2.1
PB13
  Top 0.305: U1.52 48.3,32.66 JP2.2
PB14
  Top 0.305: JP2.3 53.21,40.11 53.21,38.24 47.8,32.82 U1.53
PB15
  Top 0.305: U1.54 47.3,34.2 JP2.4
PC0
  Top 0.305: JP4.9 43.18,2.99 43.18,4.9 43.91,5.63 43.91,6.96 44.39,7.44 44.39,9.98 43.8,10.57 U1.15
PC1
  Top 0.305: U1.16 44.3,10.73 44.86,10.17 44.86,7.25 44.45,6.84 JP4.10
PC2
  Top 0.305: U1.17 44.8,10.9 45.32,10.38 45.32,5.19 45.72,4.79 45.72,2.99 JP4.11
PC3
  Top 0.305: U1.18 45.3,11.07 45.78,10.58 45.78,5.47 JP4.12
PC4
  Top 0.305: JP1.6 55.59,16.68 55.59,17.82 53.37,20.04 U1.33
PC5
  Top 0.305: JP1.7 58.42,16.39 56.9,16.39 56.07,17.22 56.07,18.08 53.6,20.54 U1.34
PC6
  Top 0.305: U1.63 42.8,35.95 40.51,38.24 40.51,40.11 JP2.13
PC7
  Top 0.305: U1.64 42.3,35.78 JP2.14
PC8
  Top 0.305: U1.65 41.8,35.2 39.5,37.51 38.7,37.51 37.97,38.24 37.97,40.11 JP2.15
PC9
  Top 0.305: U1.66 41.3,35.04 39.31,37.03 38.51,37.03 JP2.16
PC10  (via drill 0.38)
  Top 0.305: v31.37,26.73 32.54,27.92 33.72,27.92 34.09,27.54 U1.78 | v29.5,24.86 29.5,23.63 11.3,5.44 10.19,5.44 9.62,4.87 9.62,2.9 JP3.1
  Bottom 0.305: v31.37,26.73 v29.5,24.86
PC11  (via drill 0.38)
  Top 0.305: v32.32,26.73 33.02,27.44 33.53,27.44 33.93,27.04 U1.79 | JP3.2 30.45,23.92 v30.45,24.86
  Bottom 0.305: v32.32,26.73 v30.45,24.86
PC12  (via drill 0.38)
  Top 0.305: v31.4,24.86 31.4,24.2 12.06,4.87 12.06,2.99 JP3.3 | v33.28,26.73 33.47,26.54 U1.80
  Bottom 0.305: v33.28,26.73 v31.4,24.86
PC13
  Top 0.305: U1.7 39.8,12.38 38.73,11.31 38.73,9.88 39.37,9.25 JP4.6
PC14  (via drill 0.38)
  Top 0.305: U1.8 40.3,11.42 v39.44,10.55
  Bottom 0.305: 37.62,10.65 Y2.2 38.18,10.55 | v39.44,10.55 38.18,10.55 | C19.1 38.18,11.54 38.18,10.55
PC15  (via drill 0.38)
  Top 0.305: U1.9 v40.8,16.74
  Bottom 0.305: v40.8,16.74 40.8,12.23 40.13,11.57 40.13,8.52 39.62,8.01 38.31,8.01 | Y2.1 38.31,8.01 | C20.1 38.31,6.99 38.31,8.01
PD2
  Top 0.305: JP3.4 13.34,5.47 32.91,25.04 U1.83
PD3
  Top 0.305: JP3.5 14.61,2.99 14.61,6.07 33.07,24.54 U1.84
PD4
  Top 0.305: JP3.6 15.88,6.68 33.24,24.04 U1.85
PD5
  Top 0.305: JP3.7 17.14,2.99 17.14,7.28 33.41,23.54 U1.86
PD6
  Top 0.305: JP3.8 18.41,7.88 33.57,23.04 U1.87
PD7
  Top 0.305: JP3.9 19.68,2.99 19.68,8.49 33.74,22.54 U1.88
PD8
  Top 0.305: JP2.5 50.67,40.11 50.67,38.24 46.8,34.36 U1.55
PD9
  Top 0.305: U1.56 46.3,35.74 JP2.6
PD10
  Top 0.305: JP2.7 48.13,40.11 48.13,38.24 45.8,35.9 U1.57
PD11
  Top 0.305: U1.58 45.3,37.28 JP2.8
PD12
  Top 0.305: U1.59 44.8,37.44 45.59,38.24 45.59,40.11 JP2.9
PD13
  Top 0.305: U1.60 44.3,38.81 JP2.10
PD14
  Top 0.305: U1.61 43.8,37.49 43.05,38.24 43.05,40.11 JP2.11
PD15
  Top 0.305: U1.62 43.3,37.32 JP2.12
PE0
  Top 0.305: JP3.16 28.57,12.71 33.91,18.04 U1.97
PE1
  Top 0.305: JP3.17 29.84,2.99 29.84,13.31 34.07,17.54 U1.98
PE2
  Top 0.305: U1.1 36.8,14.01 33.02,10.23 33.02,2.99 JP4.1
PE3
  Top 0.305: U1.2 37.3,13.85 34.29,10.84 JP4.2
PE4
  Top 0.305: U1.3 37.8,13.68 35.56,11.44 35.56,2.99 JP4.3
PE5
  Top 0.305: U1.4 38.3,13.51 36.83,12.04 JP4.4
PE6
  Top 0.305: U1.5 38.8,13.34 38.1,12.65 38.1,2.99 JP4.5
PE7
  Top 0.305: U1.38 54.8,22.54 JP1.10
PE8
  Top 0.305: JP1.11 58.42,21.47 56.55,21.47 54.98,23.04 U1.39
PE9
  Top 0.305: JP1.12 56.34,23.55 56.33,23.54 U1.40
PE10
  Top 0.305: U1.41 58.46,24.04 JP1.13
PE11
  Top 0.305: U1.42 56.42,24.54 JP1.14
PE12
  Top 0.305: JP1.15 58.42,26.55 56.9,26.55 55.39,25.04 U1.43
PE13
  Top 0.305: U1.44 54.88,25.54 JP1.16
PE14
  Top 0.305: JP1.17 58.42,29.09 56.9,29.09 56.07,28.27 56.07,27.54 54.58,26.04 U1.45
PE15
  Top 0.305: JP1.18 55.59,28.81 55.59,27.73 54.41,26.54 U1.46
RESET  (via drill 0.38)
  Top 0.305: U1.14 43.3,10.99 v43.12,10.74 | X2.9 15.65,33.28 12.38,30.01 9.84,30.01 8.19,28.36 R2.2 8.19,14.22 8,14.22 | v12.7,14.22 10.66,14.23 7.75,14.23 8,14.22 | 8,14.22 S1.1 8.19,14.27
  Bottom 0.305: v12.7,14.22 39.64,14.23 40.01,14.6 40.01,17.54 40.45,17.98 42.67,17.98 43.12,17.53 v43.12,10.74
USB_DM
  Top 0.305: X1.2 12.44,37.16 14.48,35.12 38.54,35.12 39.3,34.37 U1.70
USB_DP
  Top 0.305: X1.3 12.57,36.36 14.29,34.65 38.35,34.65 38.8,34.2 U1.71
USB_ID  (via drill 0.6)
  Top 0.305: X1.4 v12.25,35.56 v12.26,35.56 | v14.77,35.94 15.12,35.6 38.73,35.6 39.8,34.54 U1.69
  Bottom 0.305: v14.77,35.94 14.39,35.57 14.38,35.56 v12.26,35.56
USB_VBUS
  Top 0.406: X1.1 11.6,37.96 C16.1 C17.2 16.16,38.11 IC1.3

### Text on the board
tNames: USART3 [G|R|T] > | JTAG | CAN | BOOT | RESET | CPU Board V 1.0
bNames: Henrik Jensen / Jakob Jensen / JesperJørgensen / Peter Reichwald